# EAGLE schematic connection (EAGLE 7.2.1)
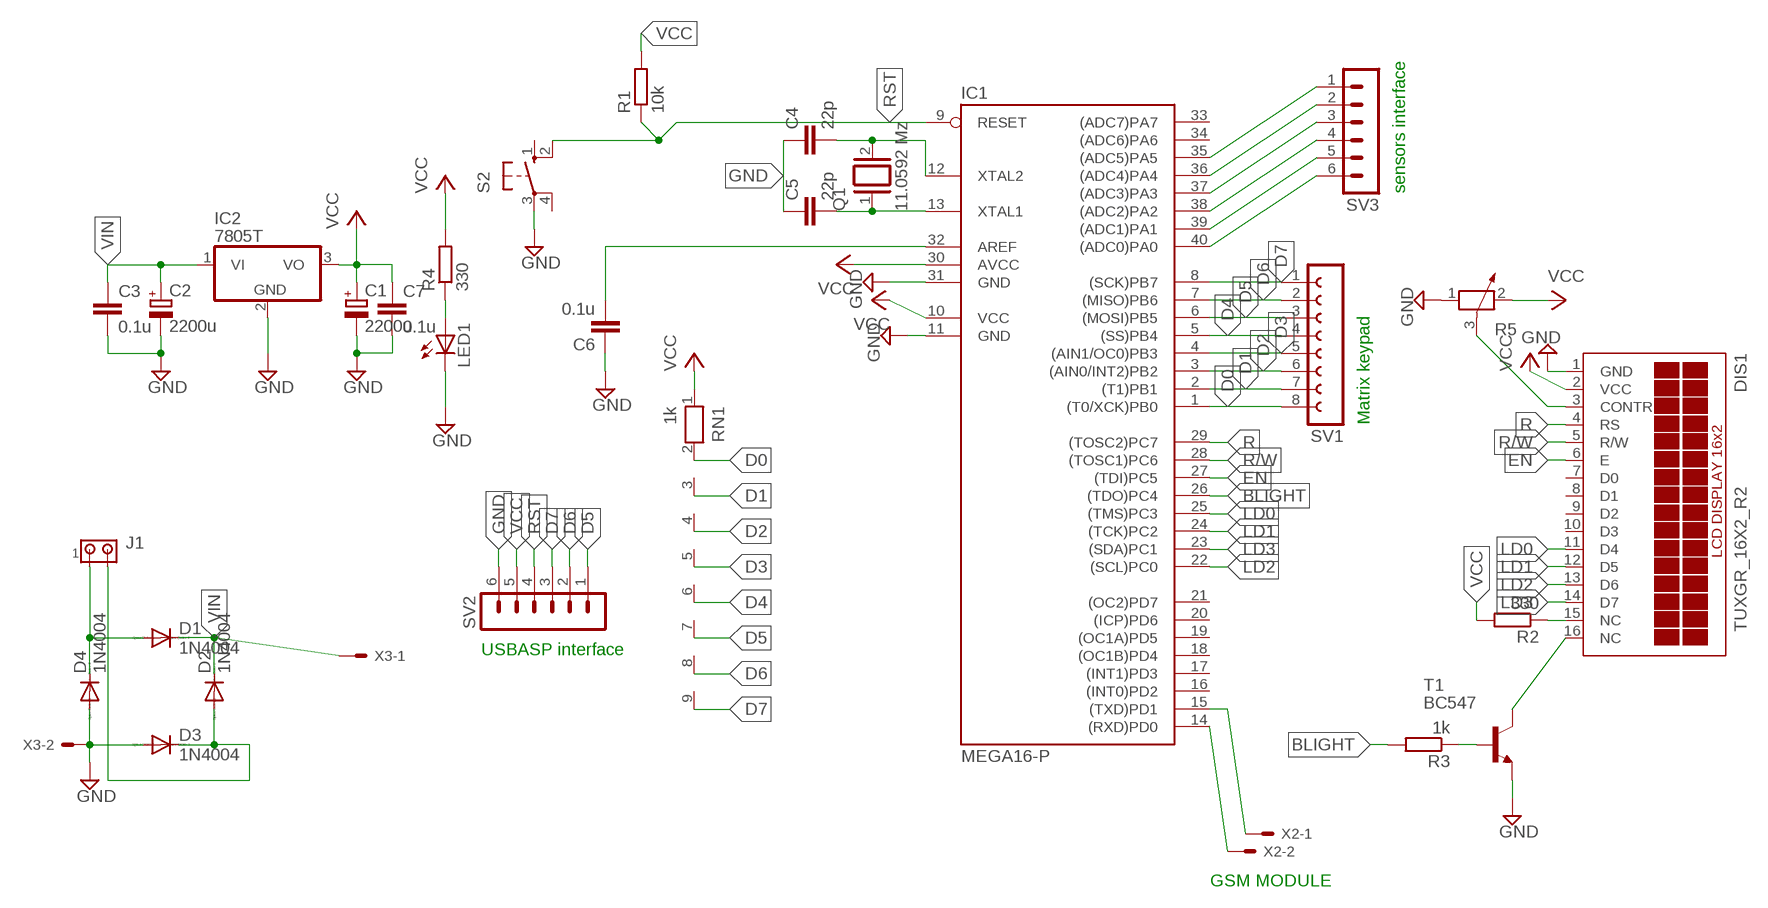
[diagram p0: schematic, sheet 1]

## Parts
C1  2200u  CPOL-EUE5-10.5  [E5-10,5]
C2  2200u  CPOL-EUE5-10.5  [E5-10,5]
C3  0.1u  C5/3  [C5B3]
C4  22p  C5/2.5  [C5B2.5]
C5  22p  C5/2.5  [C5B2.5]
C6  0.1u  C5/2.5  [C5B2.5]
C7  0.1u  C5/3  [C5B3]
D1  1N4004  [DO41-10]
D2  1N4004  [DO41-10]
D3  1N4004  [DO41-10]
D4  1N4004  [DO41-10]
DIS1  TUXGR_16X2_R2  [TUXGR_16X2_R2]
IC1  MEGA16-P  [DIL40]
IC2  7805T  [TO220H]
J1  MTA02-100  [10X02MTA]
LED1  LED5MM  [LED5MM]
Q1  11.0592 Mz  XTAL/S  [QS]
R1  10k  R-EU_0207/10  [0207/10]
R2  330  R-EU_0207/10  [0207/10]
R3  1k  R-EU_0207/10  [0207/10]
R4  330  R-EU_0207/10  [0207/10]
R5  POTENTIOMETER_PT-10  [PT-10]
RN1  1k  RN08  [RN-9]
S2  10-XX  [B3F-10XX]
SV1  FE08-1  [FE08]
SV2  MA06-1  [MA06-1]
SV3  MA06-1  [MA06-1]
T1  BC547  [TO92]
X2  KK-156-2  [KK-156-2]
X3  KK-156-2  [KK-156-2]

## Nets
BLIGHT: IC1.26((TDO)PC4) R3.2
D0: IC1.1((T0/XCK)PB0) RN1.2 SV1.8
D1: IC1.2((T1)PB1) RN1.3 SV1.7
D2: IC1.3((AIN0/INT2)PB2) RN1.4 SV1.6
D3: IC1.4((AIN1/OC0)PB3) RN1.5 SV1.5
D4: IC1.5((SS)PB4) RN1.6 SV1.4
D5: IC1.6((MOSI)PB5) RN1.7 SV1.3 SV2.1
D6: IC1.7((MISO)PB6) RN1.8 SV1.2 SV2.2
D7: IC1.8((SCK)PB7) RN1.9 SV1.1 SV2.3
EN: DIS1.6(E) IC1.27((TDI)PC5)
GND: C1.- C2.- C3.2 C4.1 C5.1 C6.1 C7.2 D3.A D4.A DIS1.1(GND) IC1.11(GND) IC1.31(GND) IC2.2(GND) LED1.K(C) R5.1 S2.3(P) SV2.6 T1.1(E) X3.2
LD0: DIS1.11(D4) IC1.25((TMS)PC3)
LD1: DIS1.12(D5) IC1.24((TCK)PC2)
LD2: DIS1.13(D6) IC1.22((SCL)PC0)
LD3: DIS1.14(D7) IC1.23((SDA)PC1)
N$1: IC1.35((ADC5)PA5) SV3.1
N$2: C6.2 IC1.32(AREF)
N$3: C4.2 IC1.12(XTAL2) Q1.2
N$4: C5.2 IC1.13(XTAL1) Q1.1
N$5: D1.A D4.C J1.1
N$6: DIS1.16(NC) T1.3(C)
N$7: D2.A D3.C J1.2
N$8: DIS1.15(NC) R2.1
N$9: R3.1 T1.2(B)
N$10: IC1.15((TXD)PD1) X2.1
N$11: IC1.14((RXD)PD0) X2.2
N$12: IC1.36((ADC4)PA4) SV3.2
N$13: LED1.A R4.1
N$14: IC1.37((ADC3)PA3) SV3.3
N$15: IC1.38((ADC2)PA2) SV3.4
N$16: IC1.39((ADC1)PA1) SV3.5
N$17: IC1.40((ADC0)PA0) SV3.6
R: DIS1.4(RS) IC1.29((TOSC2)PC7)
R/W: DIS1.5(R/W) IC1.28((TOSC1)PC6)
RS: DIS1.3(CONTR) R5.3
RST: IC1.9(RESET) R1.1 S2.2(S1) SV2.4
VCC: C1.+ C7.1 DIS1.2(VCC) IC1.10(VCC) IC1.30(AVCC) IC2.3(VO) R1.2 R2.2 R4.2 R5.2 RN1.1 SV2.5
VIN: C2.+ C3.1 D1.C D2.C IC2.1(VI) X3.1
Unconnected: DIS1.7(D0) DIS1.8(D1) DIS1.9(D2) DIS1.10(D3) IC1.16((INT0)PD2) IC1.17((INT1)PD3) IC1.18((OC1B)PD4) IC1.19((OC1A)PD5) IC1.20((ICP)PD6) IC1.21((OC2)PD7) IC1.33((ADC7)PA7) IC1.34((ADC6)PA6) S2.1(S) S2.4(P1)

## Notes on the sheet
- sensors interface
- Matrix keypad
- USBASP interface
- GSM MODULE

## Library data of the parts
C1 C2 = resistor:CPOL-EU: POLARIZED CAPACITOR, European symbol
C3-C7 = capacitor-wima:C: CAPACITOR naming: grid - package width
D1-D4 = diode:1N4004: DIODE general purpose rectifier, 1 A
DIS1 = display-lcd:TUXGR_16X2_R2: Tuxgraphics LCD display 16x2 characters reflective, without background light Source: tuxgr_12x2_r2.pdf; OC_FARNELL: unknown; OC_NEWARK: unknown
IC1 = atmel:MEGA16-P: MICROCONTROLLER 16 Kbytes FLASH 1 kbytes SRAM 512 bytes EEPROM USART 8-channel 10 bit ADC Source: avr.lbr; MPN: ATMEGA16-16PU; OC_FARNELL: 9171142; OC_NEWARK: 01M6885
IC2 = linear:78*: Positive VOLTAGE REGULATOR Source: http://cache.national.com/ds/LM/LM78L05.pdf http://www.fairchildsemi.com/ds/LM/LM7805.pdf
J1 = con-amp:MTA02-100: AMP connector
LED1 = led:LED: LED OSRAM: - CHIPLED LG R971, LG N971, LY N971, LG Q971, LY Q971, LO R971, LY R971 LH N974, LH R974 LS Q976, LO Q976, LY Q976 LO Q996 - Hyper CHIPLED LW Q18S LB Q993, LB Q99A, LB R99A - SideLED LS A670, LO A670, LY A670, LG A670, LP A670 LB A673, LV A673, LT A673, LW A673 LH A674 LY A675 LS A676, LA A676, LO A676, LY A676, LW A676 LS A679, LY A679, LG A679 - Hyper Micro SIDELED® LS Y876, LA Y876, LO Y876, LY Y876 LT Y87S - SmartLED LW L88C, LW L88S LB L89C, LB L89S, LG L890 LS L89K, LO L89K, LY L89K LS L896, LA L896, LO L896, LY L896 - TOPLED LS T670, LO T670, LY T670, LG T670, LP T670 LSG T670, LSP T670, LSY T670, LOP T670, LYG T670 LG T671, LOG T671, LSG T671 LB T673, LV T673, LT T673, LW T673 LH T674 LS T676, LA T676, LO T676, LY T676, LB T676, LH T676, LSB T676, LW T676 LB T67C, LV T67C, LT T67C, LS T67K, LO T67K, LY T67K, LW E67C LS E67B, LA E67B, LO E67B, LY E67B, LB E67C, LV E67C, LT E67C LW T67C LS T679, LY T679, LG T679 LS T770, LO T770, LY T770, LG T770, LP T770 LB T773, LV T773, LT T773, LW T773 LH T774 LS E675, LA E675, LY E675, LS T675 LS T776, LA T776, LO T776, LY T776, LB T776 LHGB T686 LT T68C, LB T68C - Hyper Mini TOPLED® LB M676 - Mini TOPLED Santana® LG M470 LS M47K, LO M47K, LY M47K Source: http://www.osram.convergy.de LUXEON: - LUMILED® LXK2-PW12-R00, LXK2-PW12-S00, LXK2-PW14-U00, LXK2-PW14-V00 LXK2-PM12-R00, LXK2-PM12-S00, LXK2-PM14-U00 LXK2-PE12-Q00, LXK2-PE12-R00, LXK2-PE12-S00, LXK2-PE14-T00, LXK2-PE14-U00 LXK2-PB12-K00, LXK2-PB12-L00, LXK2-PB12-M00, LXK2-PB14-N00, LXK2-PB14-P00, LXK2-PB14-Q00 LXK2-PR12-L00, LXK2-PR12-M00, LXK2-PR14-Q00, LXK2-PR14-R00 LXK2-PD12-Q00, LXK2-PD12-R00, LXK2-PD12-S00 LXK2-PH12-R00, LXK2-PH12-S00 LXK2-PL12-P00, LXK2-PL12-Q00, LXK2-PL12-R00 Source: www.luxeon.com KINGBRIGHT: KA-3528ASYC Source: www.kingbright.com
Q1 = special:XTAL/S: CRYSTAL
R1-R4 = resistor:R-EU_: RESISTOR, European symbol
R5 = rcl:POTENTIOMETER_: Potentiometer
RN1 = resistor-net:RN08: RESISTOR NETWORK; OC_FARNELL: unknown; OC_NEWARK: unknown
S2 = switch-omron:10-XX: OMRON SWITCH; MPN: B3F-1000; OC_FARNELL: 176432; OC_NEWARK: 36M3542
SV1 = con-lsta:FE08-1: FEMALE HEADER; OC_FARNELL: unknown; OC_NEWARK: unknown
SV2 SV3 = con-lstb:MA06-1: PIN HEADER; OC_FARNELL: unknown; OC_NEWARK: unknown
T1 = transistor:BC547: NPN TRANSISTOR
X2 X3 = con-molex:KK-156-2: KK 156 HEADER Source: http://www.molex.com/pdm_docs/sd/026604100_sd.pdf; OC_FARNELL: unknown; OC_NEWARK: unknown